# EAGLE design charger_v3.1 (EAGLE 9.6.1)
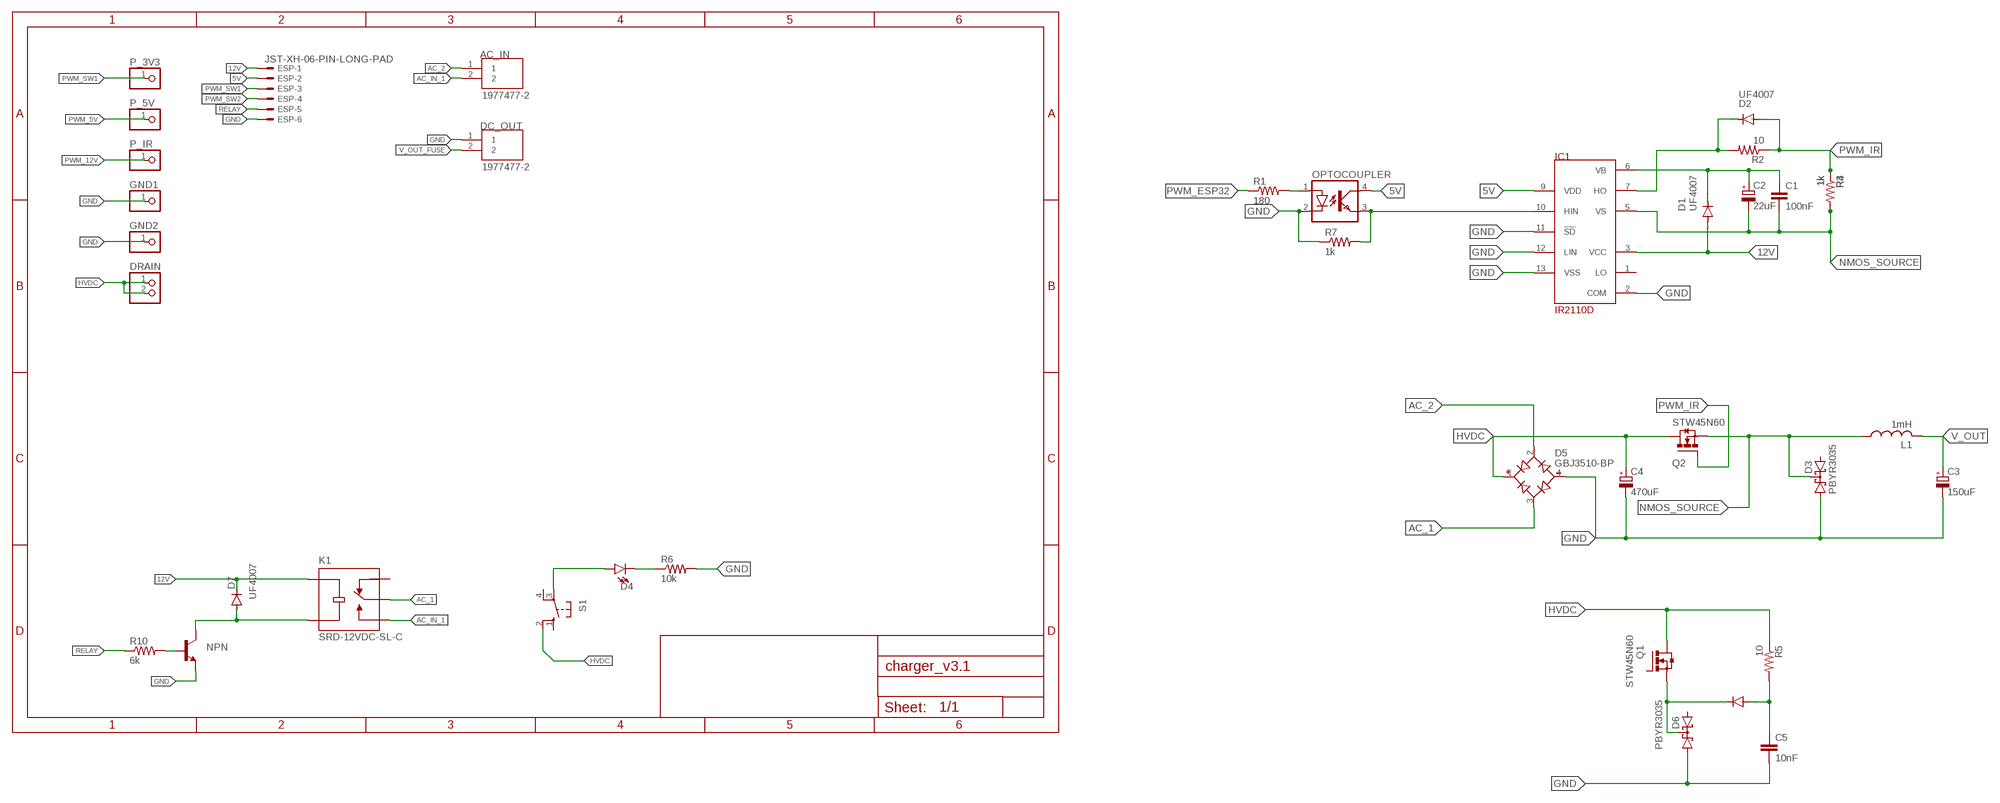
[diagram p0: schematic, sheet 1]

## Parts
AC_IN  1977477-2  [TE_1977477-2]
C1  100nF  C-EU025-025X050  [C025-025X050]
C2  22uF  CPOL-EUE2,5-6E  [E2,5-6E]
C3  150uF  CPOL-EUE7.5-18  [E7,5-18]
C4  470uF  CPOL-EUE10-35  [EB35D]
C5  10nF  C-EU025-025X050  [C025-025X050]
D1  UF4007  BAS15  [DO34-7]
D2  UF4007  BAS15  [DO34-7]
D3  PBYR3035  [SOT93S]
D4  LED5MM  [LED_5MM]
D5  GBJ3510-BP  [DIOB_GBJ3510-BP]
D6  PBYR3035  [SOT93S]
D7  UF4007  BAS15  [DO34-7]
D8  1N4148DO35-7  [DO35-7]
DC_OUT  1977477-2  [TE_1977477-2]
DRAIN  PINHD-1X2  [1X02]
ESP  JST-XH-06-PIN-LONG-PAD  [JST-XH-06-PACKAGE-LONG-PAD]
GND1  PINHD-1X1  [1X01]
GND2  PINHD-1X1  [1X01]
IC1  IR2110D  [DIL14]
K1  SRD-12VDC-SL-C  [RELAY_SRD-12VDC-SL-C]
L1  1mH  L-USTJ7-U1  [TJ7-U1]
NPN  BC547A-NPN-TO92-CBE  [TO92-CBE]
OPTOCOUPLER  SFH618A-5  [DIP4]
P_3V3  PINHD-1X1  [1X01]
P_5V  PINHD-1X1  [1X01]
P_IR  PINHD-1X1  [1X01]
Q1  STW45N60  IRFP240  [TO247AC]
Q2  STW45N60  IRFP240  [TO247AC]
R1  180  R-US_0204/7  [0204/7]
R2  10  R-US_0204/7  [0204/7]
R3  1k  R-US_0204/7  [0204/7]
R4  1k  R-US_0204/7  [0204/7]
R5  10  R-US_0204/7  [0204/7]
R6  10k  R-US_0204/7  [0204/7]
R7  1k  R-US_0204/7  [0204/7]
R10  6k  R-US_0204/7  [0204/7]
S1  10-XX  [B3F-10XX]

## Nets
5V: ESP.2 IC1.9(VDD) OPTOCOUPLER.4(COL)
12V: D1.A D7.C ESP.1 IC1.3(VCC) K1.COIL1
AC_1: D5.3(AC2) K1.COM
AC_2: AC_IN.1 D5.2(AC1)
AC_IN_1: AC_IN.2 K1.NO
GND: C3.- C4.- D3.A1 D5.4(-) DC_OUT.1 ESP.6 GND1.1 GND2.1 IC1.2(COM) IC1.11(!SD) IC1.12(LIN) IC1.13(VSS) NPN.E OPTOCOUPLER.2(C) R6.2 R7.1
HVDC: C4.+ D5.1(+) DRAIN.1 DRAIN.2 Q2.2(D) S1.2(S1)
N$1: D2.C IC1.7(HO) R2.2
N$2: D4.A S1.3(P)
N$3: C5.2 D6.A1
N$4: D6.C D8.C Q1.3(S)
N$5: Q1.2(D) R5.1
N$6: C5.1 D8.A R5.2
N$8: D4.K(C) R6.1
N$9: OPTOCOUPLER.1(A) R1.2
N$13: NPN.B R10.2
N$14: D7.A K1.COIL2 NPN.C
NMOS_SOURCE: C1.2 C2.- D3.C IC1.5(VS) L1.1 Q2.3(S) R3.2 R4.2
PWM_5V: IC1.10(HIN) OPTOCOUPLER.3(EMIT) P_5V.1 R7.2
PWM_12V [pwm_12]: P_IR.1
PWM_ESP32: R1.1
PWM_IR [pwm_12]: D2.A Q2.1(G) R2.1 R3.1 R4.1
PWM_SW1: ESP.3 P_3V3.1
PWM_SW2: ESP.4
RELAY: ESP.5 R10.1
V_OUT: C3.+ L1.2
V_OUT_FUSE: DC_OUT.2
VB: C1.1 C2.+ D1.C IC1.6(VB)
Unconnected: D3.A2 D6.A2 IC1.1(LO) K1.NC Q1.1(G) S1.1(S) S1.4(P1)

## Library data of the parts
AC_IN DC_OUT = terminal_block_TA:1977477-2: Check availability <https://pricing.snapeda.com/parts/1977477-2/TE%20Connectivity/view-part?ref=eda>; AVAILABILITY: In Stock; COMMENT: 1977477-2; DESCRIPTION: Conn Barrier Strip 2 POS 8.25mm Solder ST Thru-Hole 15A/Contact Carton; MF: TE Connectivity; MP: 1977477-2; PACKAGE: None; PRICE: None; PURCHASE-URL: https://pricing.snapeda.com/search/part/1977477-2/?ref=eda
C1 C5 = rcl:C-EU: CAPACITOR, European symbol; SPICEPREFIX: C
C2-C4 = rcl:CPOL-EU: POLARIZED CAPACITOR, European symbol; SPICEPREFIX: C
D1 D2 D7 = diode:BAS15: DIODE high speed
D3 D6 = diode:PBYR3035: Dual DIODE common cathode
D4 = Sparkfun_LED:LED: LED (Generic) Standard schematic elements and footprints for 5mm, 3mm, 1206, and 0603 sized LEDs. Generic LEDs with no color specified.
D5 = GBJ3510-BP:GBJ3510-BP: Diode Rectifier Bridge Single 1KV 35A 4-Pin(4+Tab) Case GBJ Bulk/Tube Check availability <https://pricing.snapeda.com/parts/GBJ3510-BP/Micro%20Commercial/view-part?ref=eda>; AVAILABILITY: In Stock; DESCRIPTION: Bridge Rectifier Single Phase Standard 1 kV Through Hole GBJ; MF: Micro Commercial; MP: GBJ3510-BP; PACKAGE: SIP-4 Micro Commercial Co; PRICE: None; PURCHASE-URL: https://pricing.snapeda.com/search/part/GBJ3510-BP/?ref=eda
D8 = diode:1N4148: DIODE high speed (Philips)
DRAIN = pinhead:PINHD-1X2: PIN HEADER
ESP = Rembrandt Electronics - JST XH Connectors v1-0:JST-XH-06-PIN: JST XH Connector 2 Pin Wire to board connector. Pitch: 2,54 mm, (0.100") Number of pins: 6 Created by Rembrandt Electronics www.rembrandtelectronics.com
GND1 GND2 P_3V3 P_5V P_IR = pinhead:PINHD-1X1: PIN HEADER
IC1 = irs:IR2110
K1 = TA_library:SRD-12VDC-SL-C: General Purpose Non Latching 12VDC SPDT Through Hole Relays RoHS Check availability <https://pricing.snapeda.com/parts/SRD-12VDC-SL-C/Songle%20Relay/view-part?ref=eda>; AVAILABILITY: Not in stock; DESCRIPTION: General Purpose Non Latching 12VDC SPDT Through Hole Relays RoHS; MF: Songle Relay; MP: SRD-12VDC-SL-C; PACKAGE: Package; PRICE: None
L1 = custom_inductor:L-US: INDUCTOR, American symbol; SPICEPREFIX: L
NPN = transistor:*-NPN-: NPN Transistror BF959 corrected 2008.03.06
OPTOCOUPLER = optocoupler:SFH618?*: Optocoupler, Phototransistor Output, Low Input Current Source: Data sheet <http://www.vishay.com/docs/83673/sfh618.pdf>; MF: VISHAY/TELEFUNKEN; MPN: SFH618A-5; OC_FARNELL: 1469593; OC_NEWARK: 59K0259
Q1 Q2 = IRFP240(TO-247):IRFP240: MOSFET N-CH 200V 20A TO-247AC Check availability <https://pricing.snapeda.com/parts/IRFP240/Vishay%20Siliconix/view-part?ref=eda>; AVAILABILITY: In Stock; DESCRIPTION: N-Channel 200 V 20A (Tc) 150W (Tc) Through Hole TO-247AC; MF: Vishay Siliconix; MP: IRFP240; PACKAGE: TO-247 Vishay Siliconix; PRICE: None
R1-R7 R10 = rcl:R-US_: RESISTOR, American symbol; SPICEPREFIX: R
S1 = switch-omron:10-XX: OMRON SWITCH; MPN: B3F-1000; OC_FARNELL: 176432; OC_NEWARK: 36M3542

## Net classes
0 default: width 0.305 mm
1 power: width 6.985 mm, clearance 0.508 mm to class 0
2 pwm_12: width 0.305 mm, clearance 0.508 mm to class 0, clearance 0.508 mm to class 1

## Board
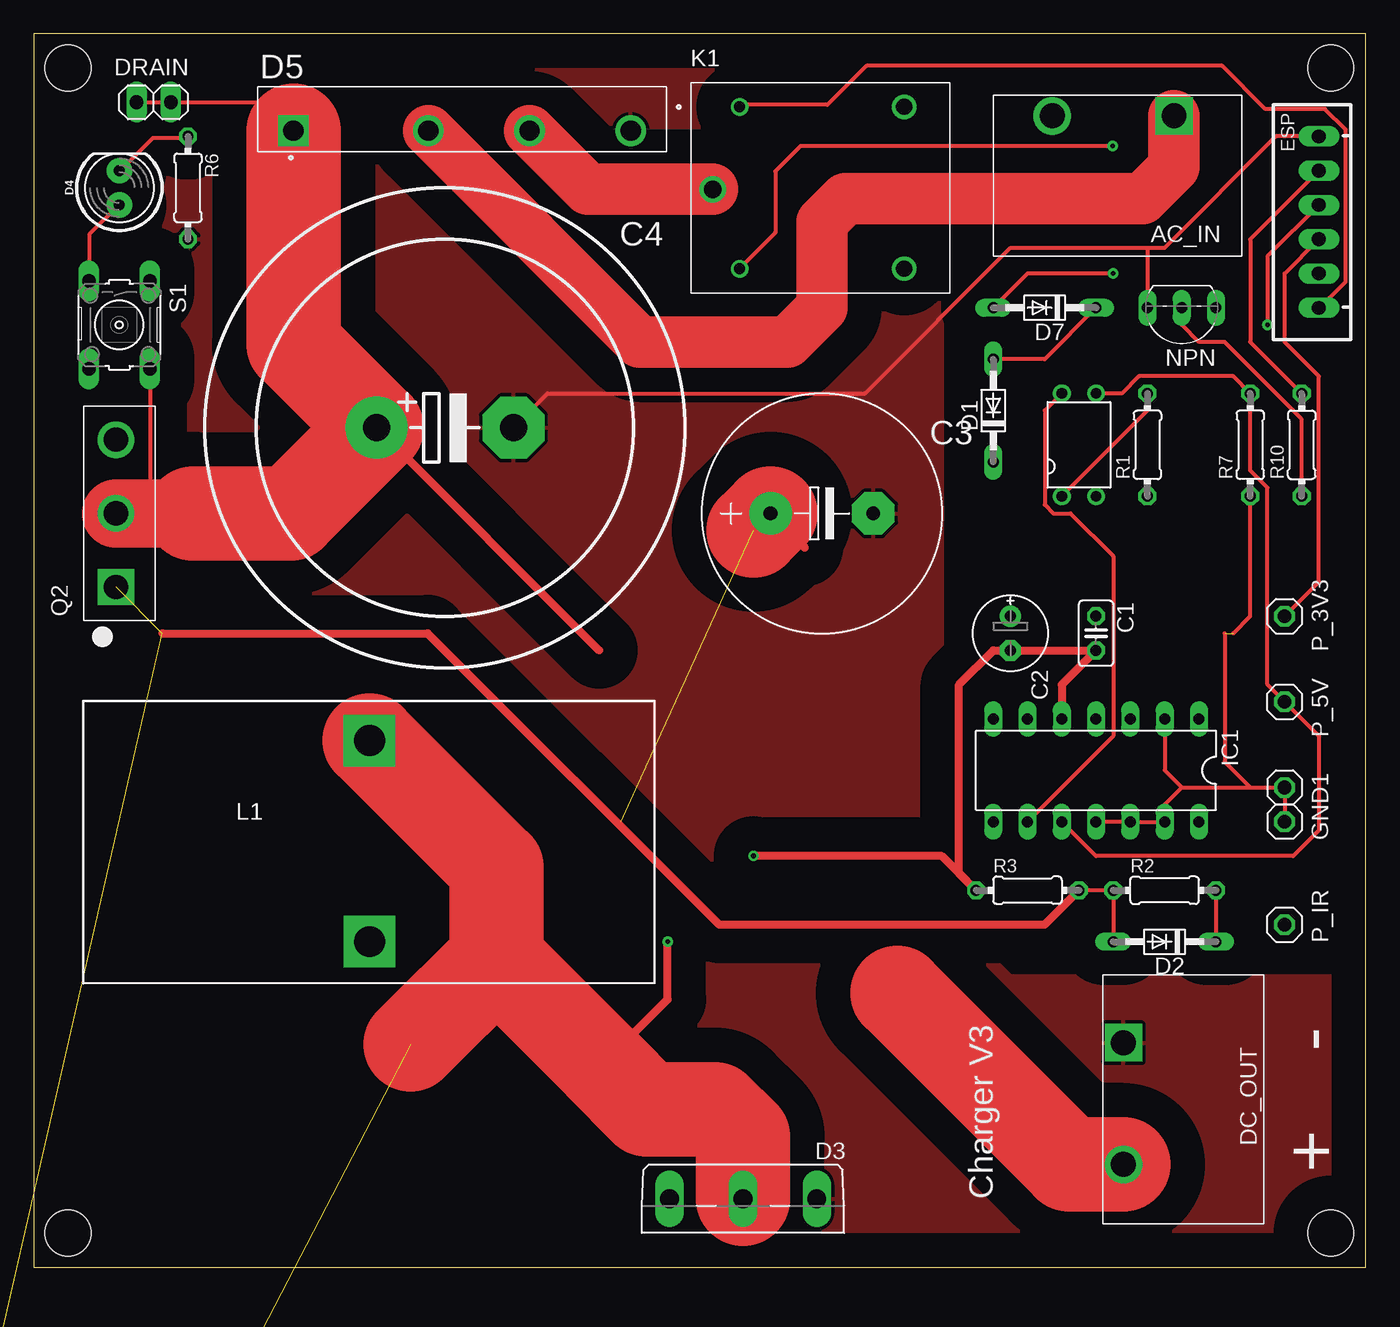
[diagram p1: board, top side]
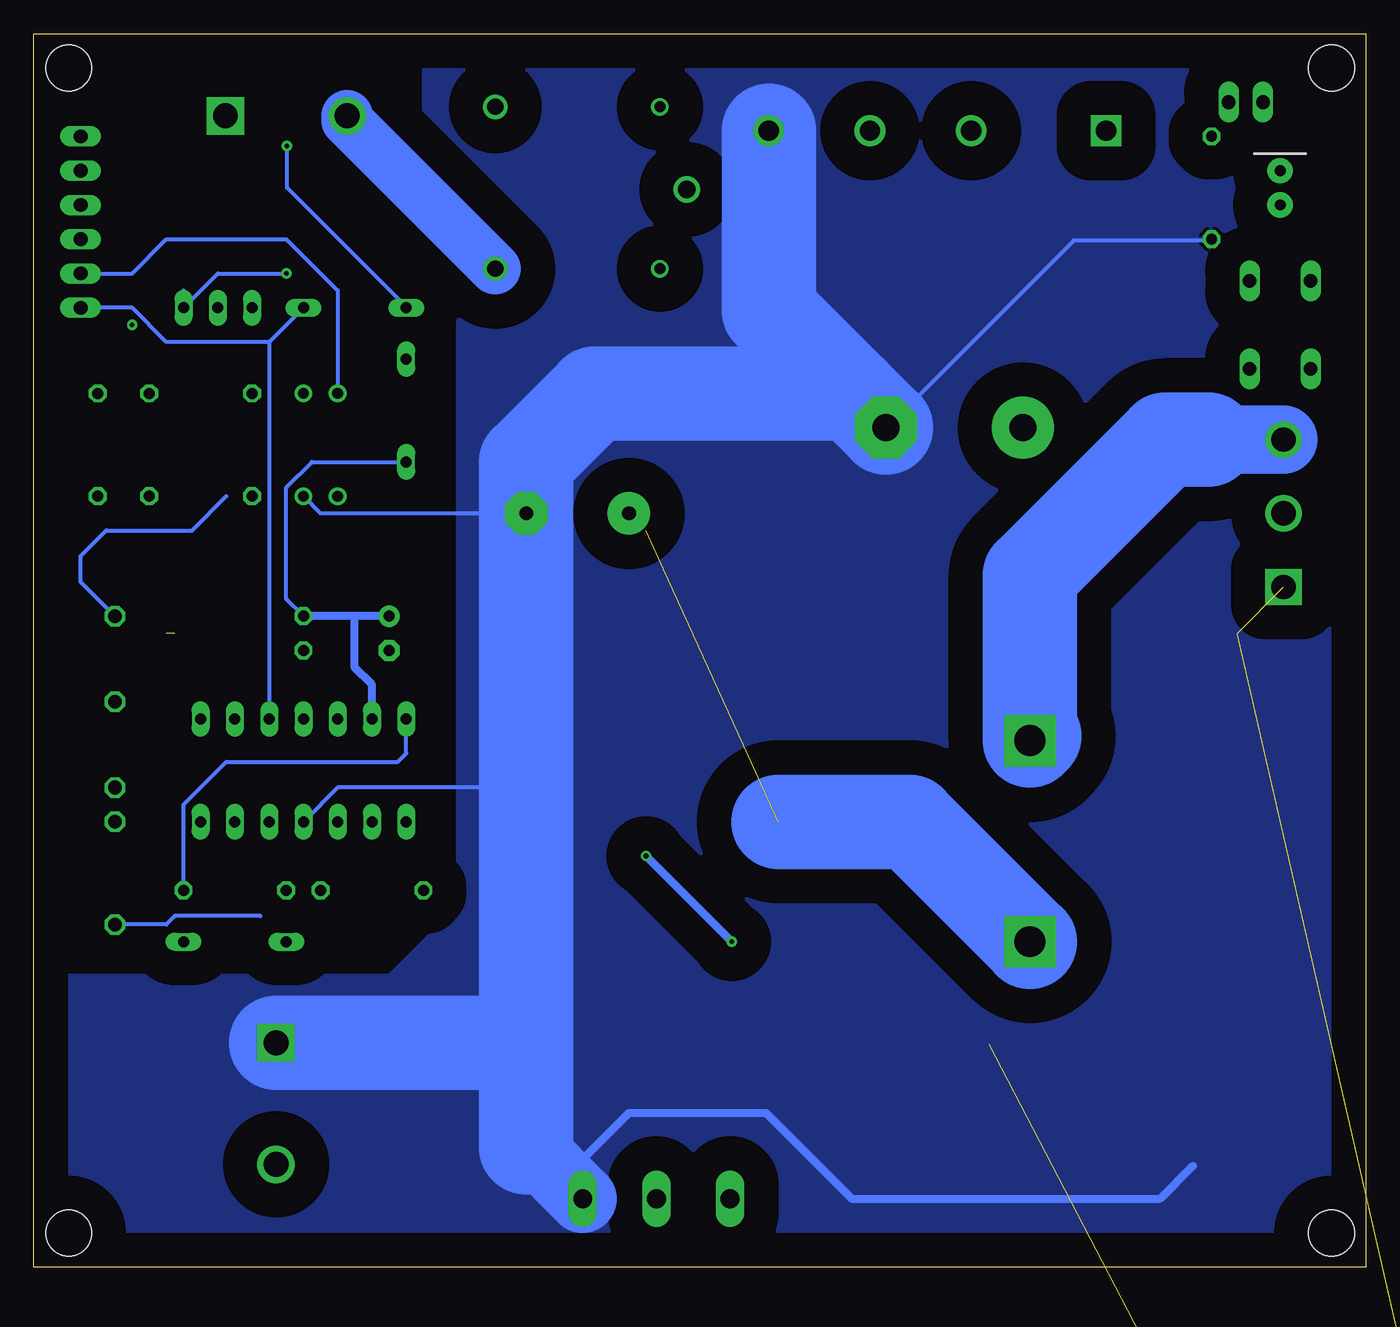
[diagram p2: board, bottom side, seen from below]

Size 98.73 x 91.43 mm. Coordinates in mm from the lower left corner, seen from the top.
Outline: 0,0 98.73,0 98.73,91.43 0,91.43 0,0
Copper layers (1*16): Top 0.035mm / dielectric 1.5mm / Bottom 0.035mm
Design rules "default *": minimum track width 12mil, minimum drill 0.35mm, track to track 12mil, track to pad 12mil, pad to pad 12mil, via to via 12mil, smd to smd 12mil, copper to edge 40mil, drill to drill 6mil, minimum pad ring 10mil, minimum via ring 8mil, stop-mask expansion 4mil, vias tented up to drill 0mil, thermal gap 10mil
Holes 3.4 mm at 2.54,88.9 96.14,88.9 2.54,2.54 96.14,2.54

### Footprints (pad centres in the part's own frame; a part is rotated, then mirrored left to right if it is on the bottom)
TE_1977477-2 = drill 1.85 square: 1 -3.241,-5.334 | drill 1.85: 2 5.781,-5.334
C025-025X050 = drill 0.813 octagon: 1 -1.27,0; 2 1.27,0
E2,5-6E = drill 0.813 pad 1.575: + -1.27,0 | drill 0.813 pad 1.575 octagon: - 1.27,0
E7,5-18 = drill 1.016 pad 3.15: + -3.81,0 | drill 1.016 pad 3.15 octagon: - 3.81,0
EB35D = drill 2.007 pad 4.597: + -5.08,0 | drill 2.007 pad 4.597 octagon: - 5.08,0
DO34-7 = drill 0.813 long: A 3.81,0; C -3.81,0
SOT93S = drill 1.397 long: A1 -5.461,-2.54; A2 5.461,-2.54; C 0,-2.54
LED_5MM = drill 0.813 pad 1.88: A -1.27,0; K 1.27,0
DIOB_GBJ3510-BP = drill 1.51 pad 2.27 square: 1 -12.5,-0.85 | drill 1.51 pad 2.27: 2 -2.5,-0.85; 3 5,-0.85; 4 12.5,-0.85
DO35-7 = drill 0.813 long: A 3.81,0; C -3.81,0
1X02 = drill 1.016 long: 1 -1.27,0; 2 1.27,0
JST-XH-06-PACKAGE-LONG-PAD = drill 1.016 long: 1 -6.35,0; 2 -3.81,0; 3 -1.27,0; 4 1.27,0; 5 3.81,0; 6 6.35,0
1X01 = drill 1.016 octagon: 1 0,0
DIL14 = drill 0.813 long: 1 -7.62,-3.81; 2 -5.08,-3.81; 3 -2.54,-3.81; 4 0,-3.81; 5 2.54,-3.81; 6 5.08,-3.81; 7 7.62,-3.81; 8 7.62,3.81; 9 5.08,3.81; 10 2.54,3.81; 11 0,3.81; 12 -2.54,3.81; 13 -5.08,3.81; 14 -7.62,3.81
RELAY_SRD-12VDC-SL-C = drill 0.8: COIL1 -6.1,6; COIL2 -6.1,-6 | drill 1.3: COM -8.1,-0.12 | drill 1.2: NC 6.1,6; NO 6.1,-6
TJ7-U1 = drill 2.286 pad 3.81 square: 1 -6.503,4.826; 2 8.408,4.826
TO92-CBE = drill 0.813 long: B 0,0; C -2.54,0; E 2.54,0
DIP4 = drill 0.8: 1 -1.27,-3.81; 2 1.27,-3.81; 3 1.27,3.81; 4 -1.27,3.81
TO247AC = drill 1.79 pad 2.69 square: 1 -5.46,0.255 | drill 1.79 pad 2.69: 2 0,0.255; 3 5.46,0.255
0204/7 = drill 0.813 octagon: 1 -3.81,0; 2 3.81,0
B3F-10XX = drill 1.016 long: 1 -3.251,2.261; 2 3.251,2.261; 3 -3.251,-2.261; 4 3.251,-2.261

### Placement (x,y rotation side)
AC_IN  81.28,80.01 180 top
C1  78.74,46.99 270 top
C2  72.39,46.99 270 top
C3  58.42,55.88 0 top
C4  30.48,62.23 0 top
C5  -8.89,-38.1 0 top  (outside the outline)
D1  71.12,63.5 90 top
D2  83.82,24.13 180 top
D3  52.58,2.54 180 top
D4  6.35,80.01 90 top
D5  31.75,85.09 0 top
D6  -3.81,-19.05 0 top  (outside the outline)
D7  74.93,71.12 180 top
D8  -6.35,-30.48 0 top  (outside the outline)
DC_OUT  86.11,13.4 270 top
DRAIN  8.89,86.36 180 top
ESP  95.25,77.47 90 top
GND1  92.71,33.02 0 top
GND2  92.71,35.56 0 top
IC1  78.74,36.83 180 top
K1  58.42,80.01 0 top
L1  20.07,32.54 270 top
NPN  85.09,71.12 180 top
OPTOCOUPLER  77.47,60.96 0 top
P_3V3  92.71,48.26 90 top
P_5V  92.71,41.91 90 top
P_IR  92.71,25.4 90 top
Q1  -2.54,-12.7 0 top  (outside the outline)
Q2  6.35,55.88 90 top
R1  82.55,60.96 90 top
R2  83.82,27.94 0 top
R3  73.66,27.94 180 top
R4  -7.62,-44.45 0 top  (outside the outline)
R5  -7.62,-49.53 0 top  (outside the outline)
R6  11.43,80.01 270 top
R7  90.17,60.96 90 top
R10  93.98,60.96 270 top
S1  6.35,69.85 270 top

### Tracks (layer width: path | path; a pad name or v marks a point on that pad's centre or on a via)
5V
  Top 0.305: IC1.9 80.01,39.37 80.01,52.7 76.83,55.88 75.56,55.88 74.93,56.52 74.93,63.5 OPTOCOUPLER.4
  Bottom 0.305: OPTOCOUPLER.4 76.2,72.39 80.01,76.2 88.9,76.2 91.44,73.66 ESP.2
12V
  Top 0.305: D1.A 74.93,67.31 D7.C | K1.COIL1 52.43,86.16 58.83,86.16 61.72,89.05 88.09,89.05 91.29,85.85 95.71,85.85 97.23,84.33 97.23,73.05 95.25,71.07 ESP.1
  Bottom 0.305: 81.28,68.58 IC1.3 | D7.C 81.28,68.58 | ESP.1 91.44,71.12 88.9,68.58 81.28,68.58
AC_1
  Top 3.81: K1.COM 41.1,79.89 D5.3
AC_2
  Top 3.81: D5.2 44.91,68.58 55.88,68.58 58.42,71.12 58.42,77.47 60.15,79.2 82.18,79.2 84.52,81.53 AC_IN.1
AC_IN_1
  Bottom 3.81: K1.NO 75.5,84.99 AC_IN.2
GND  (1 unrouted)
  Top 0.305: ESP.6 92.08,83.82 83.82,75.56 82.55,75.56 | R7.1 90.17,48.26 88.9,46.99 | GND1.1 GND2.1 90.17,35.56 | IC1.11 IC1.12 IC1.13 83.82,34.29 85.09,35.56 | 82.55,75.56 72.39,75.56 61.59,64.77 38.1,64.77 C4.- | 88.27,46.99 88.27,37.47 90.17,35.56 | 82.55,75.56 NPN.E | IC1.2 83.82,36.83 85.09,35.56 | 85.09,35.56 90.17,35.56
  Bottom 0.305: C4.- 35.51,62.23 21.64,76.1 11.43,76.1 R6.2 | OPTOCOUPLER.2 77.47,55.88 C3.- | 62.23,33.02 64.77,35.56 76.2,35.56 IC1.11 | 62.36,16.64 62.23,16.51 | D3.A1 58.04,8
  Bottom 0.61: 58.04,8 54.61,11.43 44.45,11.43 38.1,5.08 15.24,5.08 12.8,7.52
  Bottom 5.08: D3.A1 61.85,8.89 62.23,8.89
  Bottom 6.985: 62.23,8.89 62.23,16.51 62.23,33.02 C3.- 62.23,59.69 57.15,64.77 38.1,64.77 C4.- 44.25,70.92 D5.4 | DC_OUT.1 62.36,16.64
  pour Top (isolate 2.54): -10.16,99.06 69.85,99.06 69.85,78.74 67.31,76.2 67.31,26.67 72.39,21.59 97.79,21.59 99.06,20.32 99.06,-6.35 -10.16,-6.35
  pour Bottom (isolate 2.54): -12.7,99.06 69.85,99.06 69.85,77.47 67.31,74.93 67.31,26.67 72.39,21.59 97.79,21.59 99.06,20.32 99.06,-6.35 -12.7,-6.35
HVDC
  Top 0.305: 8.69,58.26 8.69,66.5 S1.2 | 8.73,58.26 8.69,58.26 | D5.1 17.13,86.36 DRAIN.1 DRAIN.2 | Q2.2 8.48,58.26 8.69,58.26
  Top 0.61: C4.+ 41.91,45.72
  Top 5.08: Q2.2 11.81,55.88
  Top 6.985: D5.1 19.25,68.38 C4.+ 19.05,55.88 11.81,55.88
N$1
  Top 0.305: R2.2 D2.C
  Bottom 0.305: IC1.7 71.12,38.1 71.75,37.47 84.45,37.47 87.63,34.29 R2.2
N$2
  Top 0.305: S1.3 4.12,73.2 4.12,76.56 6.25,78.69 D4.A
N$3  (1 unrouted)
N$4  (2 unrouted)
N$5  (1 unrouted)
N$6  (2 unrouted)
N$8
  Top 0.305: R6.1 11.43,83.72 8.84,83.72 6.4,81.28 D4.K
N$9
  Top 0.305: R1.2 82.55,63.5 OPTOCOUPLER.1
N$13
  Top 0.305: R10.2 93.98,62.87 88.27,68.58 86.36,68.58 85.09,69.85 NPN.B
N$14  (via drill 0.35)
  Top 0.305: v80.01,73.66 73.66,73.66 D7.A | v79.96,83.11 56.84,83.11 54.97,81.23 54.97,76.7 K1.COIL2
  Bottom 0.305: 87.63,72.39 NPN.C 85.09,73.66 v80.01,73.66 | v79.96,83.11 79.96,80.01 71.17,71.22 D7.A
NMOS_SOURCE  (via drill 0.35)  (1 unrouted)
  Top 0.61: IC1.5 76.2,43.18 C1.2 C2.- 71.12,45.72 68.58,43.18 68.58,29.21 R3.2 67.31,30.48 v53.34,30.48 | 42.15,15 46.99,19.84 v46.99,24.13
  Top 6.985: L1.1 34.29,29.64 34.29,22.86 | 34.29,22.86 42.15,15 45.43,11.72 50.51,11.72 52.58,9.65 D3.C | 27.94,16.51 34.29,22.86
  Bottom 0.61: v53.34,30.48 v46.99,24.13
  Bottom 5.08: Q2.3 11.68,61.34
  Bottom 6.985: 11.68,61.34 14.86,61.34 24.89,51.31 L1.1 24.56,39.37
PWM_5V
  Top 0.305: OPTOCOUPLER.3 80.64,64.77 81.92,66.04 88.9,66.04 R7.2 90.17,59.05 91.44,57.78 91.44,43.18 P_5V.1 95.25,39.37 95.25,32.38 93.34,30.48 78.74,30.48 IC1.10
PWM_12V
  Bottom 0.305: P_IR.1 88.9,25.4 88.27,26.04 81.92,26.04
PWM_IR  (2 unrouted)
  Top 0.305: R3.1 R2.1 D2.A
  Top 0.61: 9.53,46.99 29.21,46.99 50.8,25.4 74.93,25.4 R3.1
PWM_SW1
  Top 0.305: ESP.3 92.71,73.66 92.71,68.58 95.25,66.04 95.25,50.8 P_3V3.1
  Bottom 0.305: 84.45,57.15 87,54.61 93.34,54.61 95.25,52.7 95.25,50.8 P_3V3.1
PWM_SW2  (via drill 0.35)
  Top 0.305: v91.44,69.85 91.44,74.93 ESP.4
RELAY
  Top 0.305: R10.1 90.17,68.58 90.17,76.2 ESP.5
V_OUT  (1 unrouted)
  Top 0.61: C3.+ 57.15,53.34
  Top 6.985: 53.34,54.61 C3.+
  Bottom 6.985: L1.2 33.78,33.02 43.54,33.02
V_OUT_FUSE
  Top 6.985: DC_OUT.2 76.71,7.62 64.01,20.32
VB
  Bottom 0.305: D1.C 78.11,59.69 80.01,57.78 80.01,49.53 C1.1
  Bottom 0.61: IC1.6 73.66,43.18 74.93,44.45 74.93,48.26 | 74.93,48.26 C1.1 | C2.+ 74.93,48.26

### Text on the board
tPlace: - | +
tNames: Charger V3